# EAGLE design Robot (EAGLE 7.6.0)
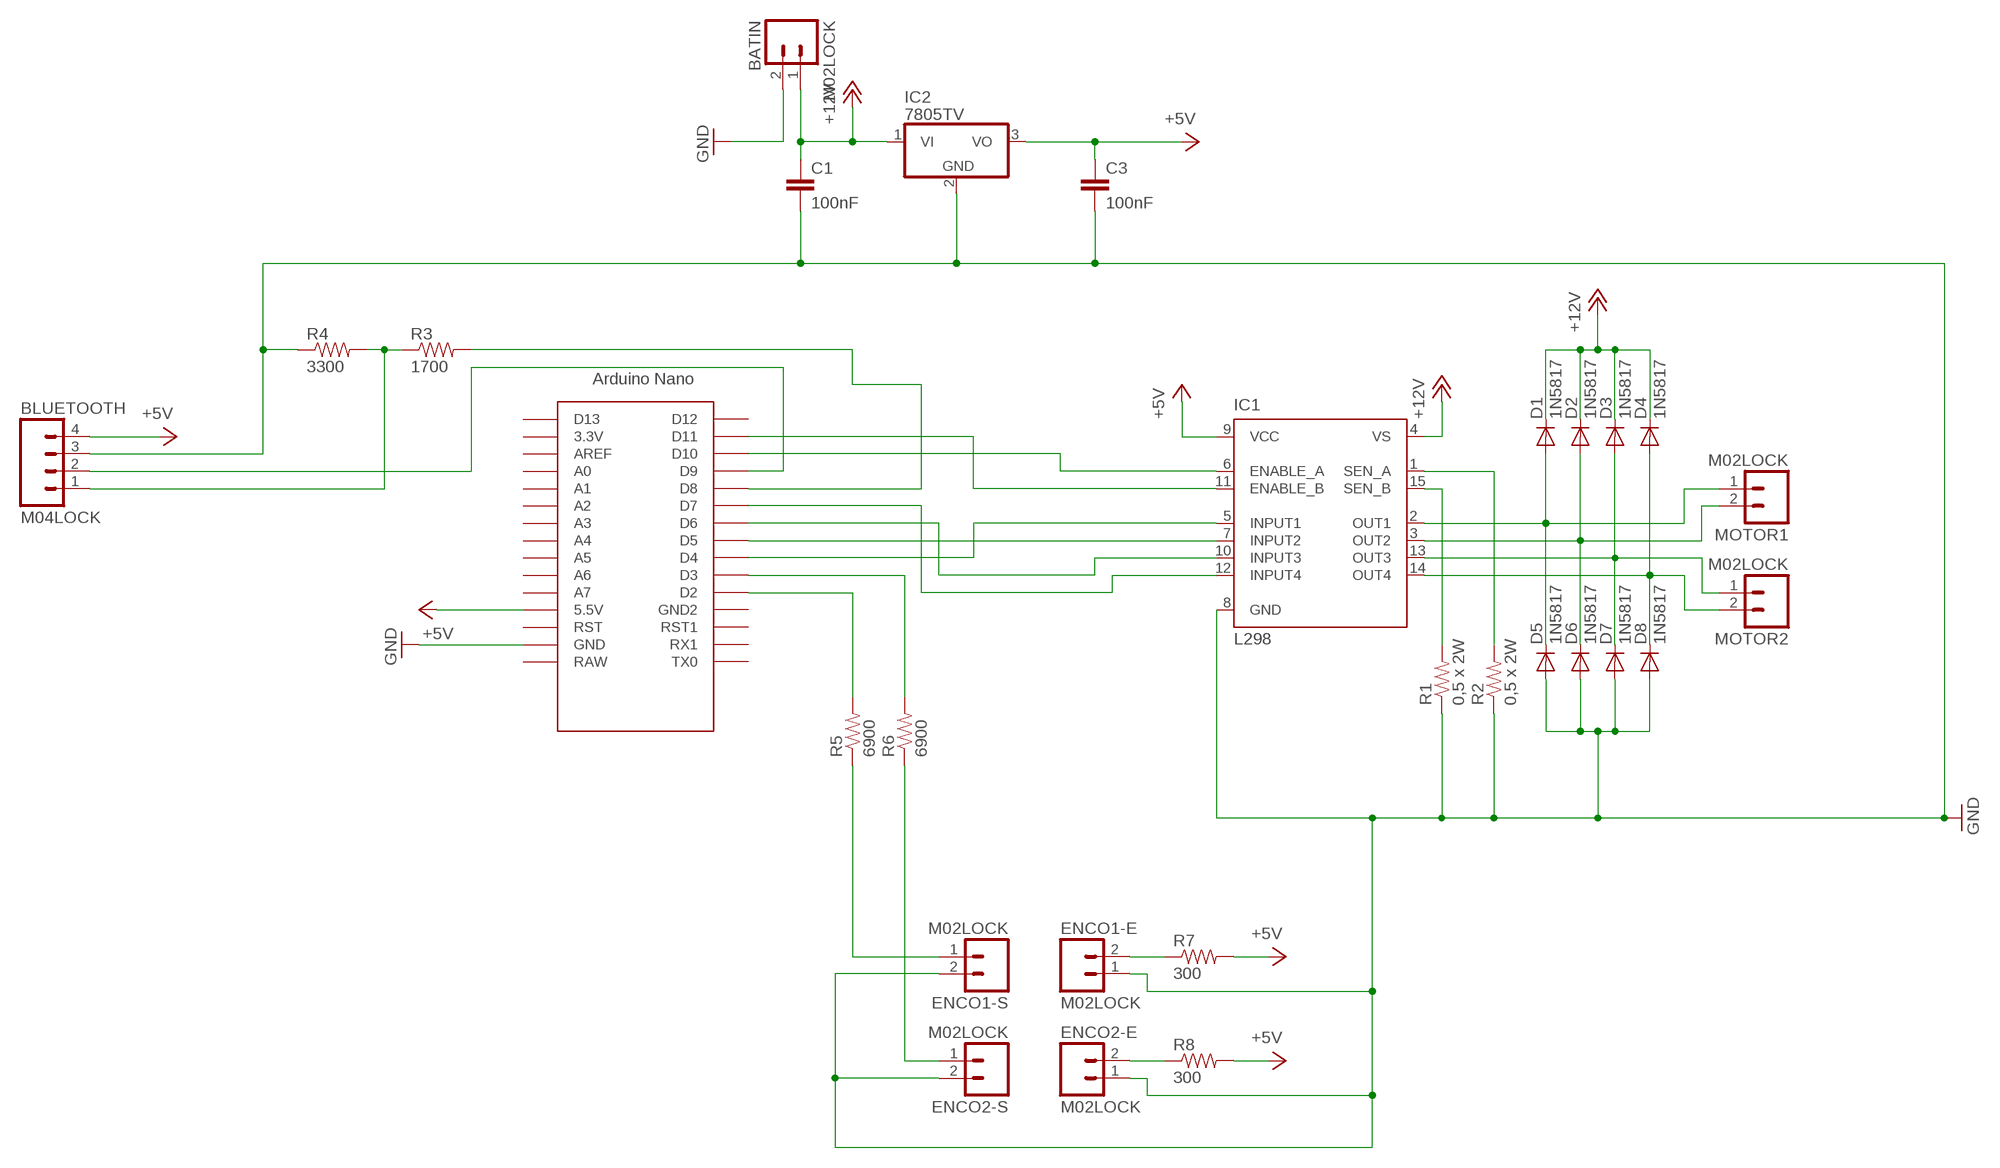
[diagram p0: schematic, sheet 1]

## Parts
BATIN  M02LOCK  [1X02_LOCK]
BLUETOOTH  M04LOCK  [1X04_LOCK]
C1  100nF  C-EU050-025X075  [C050-025X075]
C3  100nF  C-EU050-025X075  [C050-025X075]
D1  1N5817  1N4004  [DO41-10]
D2  1N5817  1N4004  [DO41-10]
D3  1N5817  1N4004  [DO41-10]
D4  1N5817  1N4004  [DO41-10]
D5  1N5817  1N4004  [DO41-10]
D6  1N5817  1N4004  [DO41-10]
D7  1N5817  1N4004  [DO41-10]
D8  1N5817  1N4004  [DO41-10]
ENCO1-E  M02LOCK  [1X02_LOCK]
ENCO1-S  M02LOCK  [1X02_LOCK]
ENCO2-E  M02LOCK  [1X02_LOCK]
ENCO2-S  M02LOCK  [1X02_LOCK]
IC1  L298  [MULTIWATT-15]
IC2  7805TV  [TO220V]
MOTOR1  M02LOCK  [1X02_LOCK]
MOTOR2  M02LOCK  [1X02_LOCK]
R1  0,5 x 2W  RESISTORPTH-1/2W  [AXIAL-0.5]
R2  0,5 x 2W  RESISTORPTH-1/2W  [AXIAL-0.5]
R3  1700  RESISTORAXIAL-0.3  [AXIAL-0.3]
R4  3300  RESISTORAXIAL-0.3  [AXIAL-0.3]
R5  6900  RESISTORAXIAL-0.3  [AXIAL-0.3]
R6  6900  RESISTORAXIAL-0.3  [AXIAL-0.3]
R7  300  RESISTORAXIAL-0.3  [AXIAL-0.3]
R8  300  RESISTORAXIAL-0.3  [AXIAL-0.3]
U$1  NANO  [NANO]

## Nets
+5V: BLUETOOTH.4 C3.1 IC1.9(VCC) IC2.3(VO) R7.P$2 R8.P$2 U$1.5V(5.5V)
+12V [12V]: BATIN.1 C1.1 D1.C D2.C D3.C D4.C IC1.4(VS) IC2.1(VI)
GND [12V]: BATIN.2 BLUETOOTH.3 C1.2 C3.2 D5.A D6.A D7.A D8.A ENCO1-E.1 ENCO1-S.2 ENCO2-E.1 ENCO2-S.2 IC1.8(GND) IC2.2(GND) R1.P$1 R2.P$1 R4.P$1 U$1.GND
N$1 [12V]: D1.A D5.C IC1.2(OUT1) MOTOR1.1
N$2: D3.A D7.C IC1.13(OUT3) MOTOR2.1
N$3: IC1.7(INPUT2) U$1.D5
N$4: D4.A D8.C IC1.14(OUT4) MOTOR2.2
N$6: R3.P$2 U$1.D8
N$7: D2.A D6.C IC1.3(OUT2) MOTOR1.2
N$8: IC1.5(INPUT1) U$1.D4
N$9: IC1.1(SEN_A) R2.P$2
N$10: IC1.15(SEN_B) R1.P$2
N$11: IC1.6(ENABLE_A) U$1.D10
N$12: BLUETOOTH.1 R3.P$1 R4.P$2
N$13: R5.P$2 U$1.D2
N$14: IC1.11(ENABLE_B) U$1.D11
N$15: IC1.10(INPUT3) U$1.D6
N$17: IC1.12(INPUT4) U$1.D7
N$18: BLUETOOTH.2 U$1.D9
N$20: R6.P$2 U$1.D3
N$21: ENCO1-S.1 R5.P$1
N$22: ENCO2-S.1 R6.P$1
N$23: ENCO1-E.2 R7.P$1
N$24: ENCO2-E.2 R8.P$1
Unconnected: U$1.3.3V U$1.A0 U$1.A1 U$1.A2 U$1.A3 U$1.A4 U$1.A5 U$1.A6 U$1.A7 U$1.AREF U$1.D12 U$1.D13 U$1.GND1(GND2) U$1.ICSP1 U$1.ICSP2 U$1.ICSP3 U$1.ICSP4 U$1.ICSP5 U$1.ICSP6 U$1.RAW U$1.RST U$1.RST1 U$1.RX1 U$1.TX0

## Library data of the parts
BATIN ENCO1-E ENCO1-S ENCO2-E ENCO2-S MOTOR1 MOTOR2 = SparkFun-Connectors:M02: Standard 2-pin 0.1" header. Use with - straight break away headers ( PRT-00116) - right angle break away headers (PRT-00553) - swiss pins (PRT-00743) - machine pins (PRT-00117) - female headers (PRT-00115) Molex polarized connector foot print use with: PRT-08233 with associated crimp pins and housings. 2.54_SCREWTERM for use with PRT-10571. 3.5mm Screw Terminal footprints for PRT-08084 5mm Screw Terminal footprints for use with PRT-08432
BLUETOOTH = SparkFun-Connectors:M04: Header 4 Standard 4-pin 0.1" header. Use with straight break away headers (SKU : PRT-00116), right angle break away headers (PRT-00553), swiss pins (PRT-00743), machine pins (PRT-00117), and female headers (PRT-00115). Molex polarized connector foot print use with SKU : PRT-08231 with associated crimp pins and housings. 1MM SMD Version SKU: PRT-10208; PROD_ID: CONN-09696
C1 C3 = resistor:C-EU: CAPACITOR, European symbol
D1-D8 = diode:1N4004: DIODE general purpose rectifier, 1 A
IC1 = st-microelectronics:L298: DUAL FULL-BRIDGE DRIVER
IC2 = linear:78*: Positive VOLTAGE REGULATOR Source: http://cache.national.com/ds/LM/LM78L05.pdf http://www.fairchildsemi.com/ds/LM/LM7805.pdf
R1-R8 = SparkFun-Resistors:RESISTOR: Resistor Basic schematic elements and footprints for 0603, 1206, and PTH resistors.
U$1 = Arduino-clone:NANO: Arduino Nano

## Net classes
0 default: width 0.254 mm
1 12V: width 0.508 mm

## Board
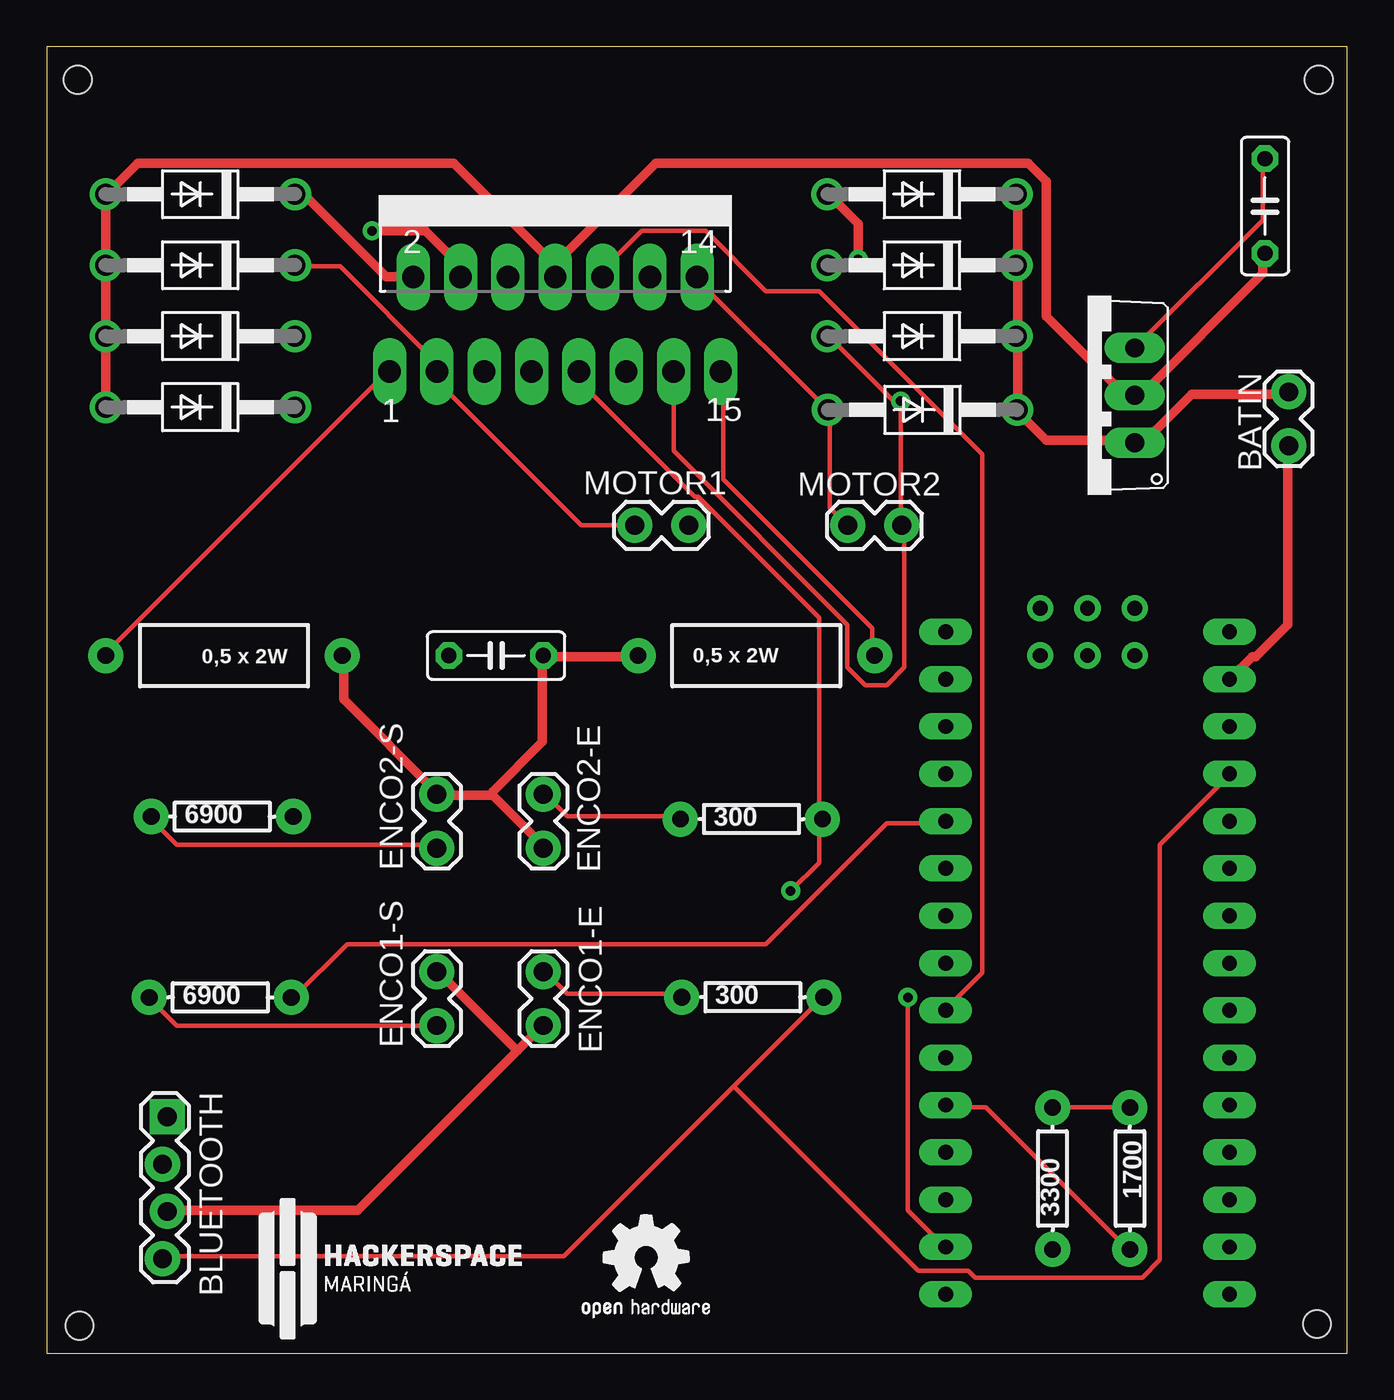
[diagram p1: board, top side]
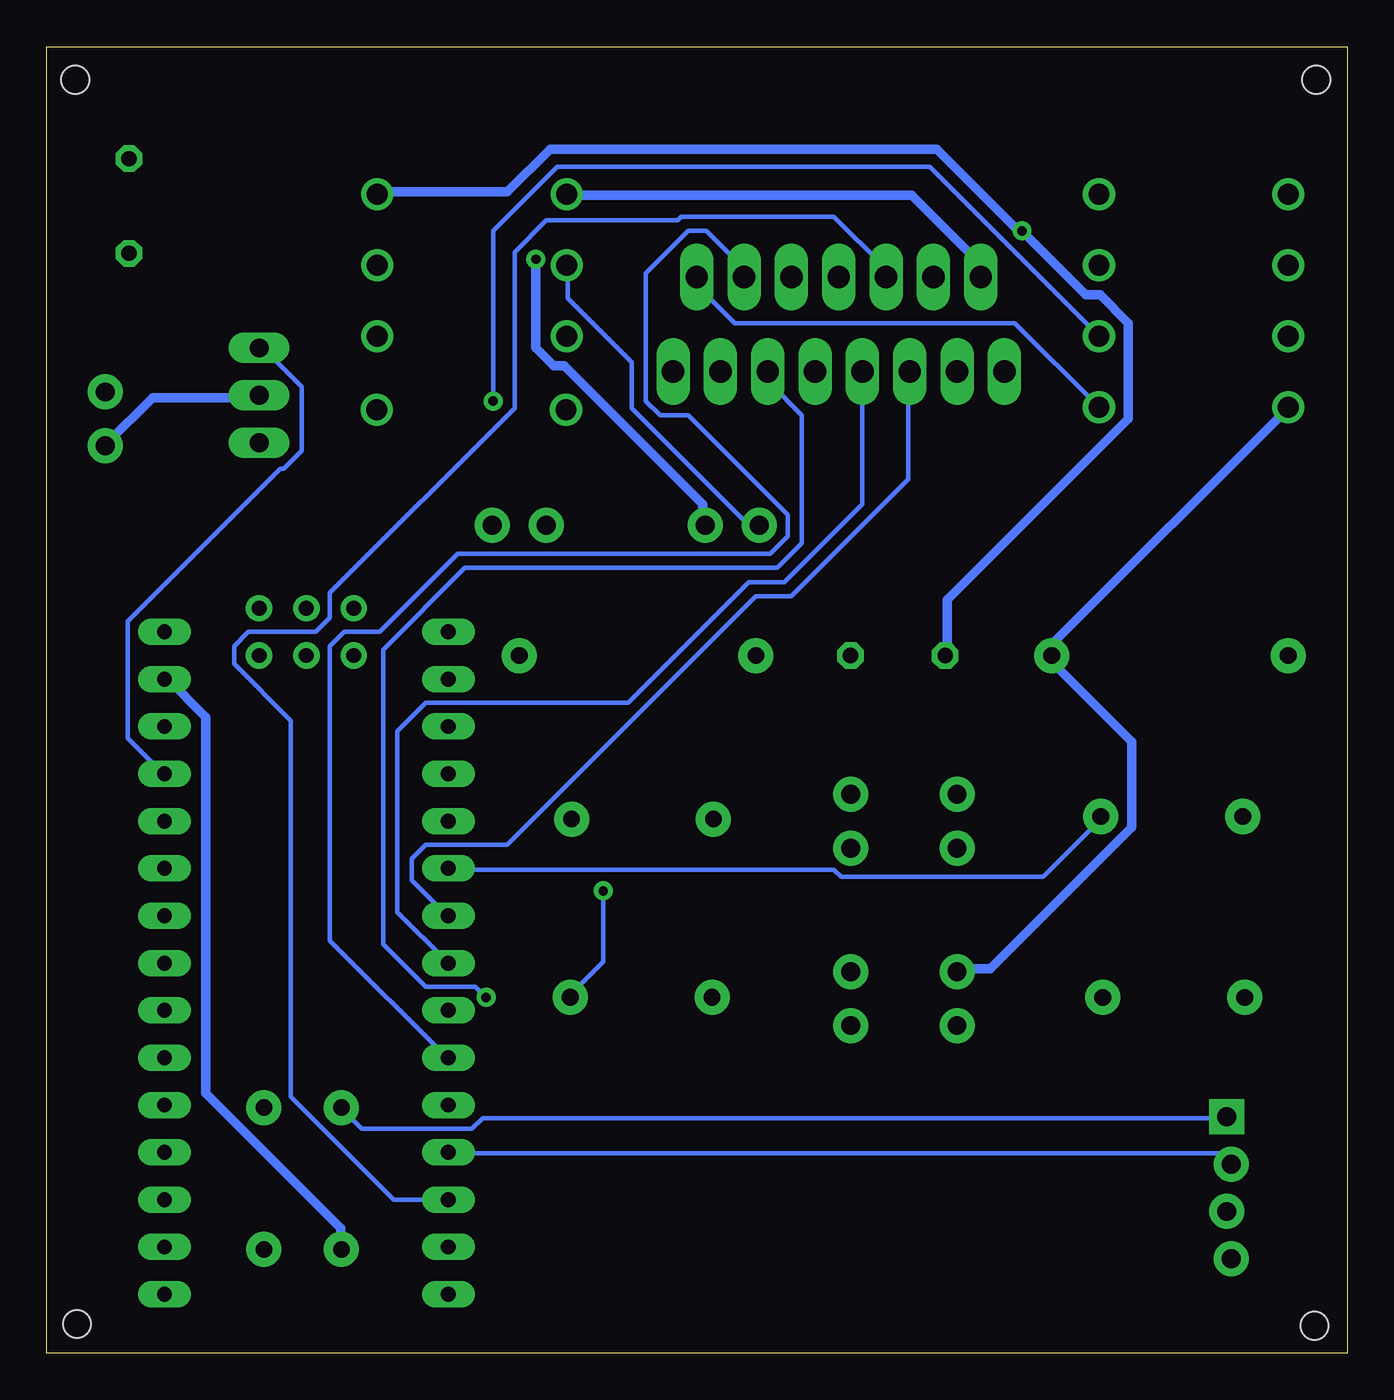
[diagram p2: board, bottom side, seen from below]

Size 69.83 x 70.16 mm. Coordinates in mm from the lower left corner, seen from the top.
Outline: 0,0 69.83,0 69.83,70.15 0,70.15 0,0
Copper layers (1*16): Top 0.035mm / dielectric 1.5mm / Bottom 0.035mm
Design rules "SparkFun *": minimum track width 8mil, minimum drill 20mil, track to track 20mil, track to pad 15mil, pad to pad 8mil, via to via 8mil, smd to smd 8mil, copper to edge 8mil, drill to drill 8mil, minimum pad ring 12mil, minimum via ring 10mil, stop-mask expansion 4mil, vias tented up to drill 20mil, thermal gap 10mil
Holes 1.5 mm at 1.67,68.37 68.29,68.37 68.2,1.58 1.76,1.48

### Footprints (pad centres in the part's own frame; a part is rotated, then mirrored left to right if it is on the bottom)
1X02_LOCK = drill 1.016 pad 1.88: 1 -0.178,0; 2 2.718,0
1X04_LOCK = drill 1.016 pad 1.88 square: 1 0,0.127 | drill 1.016 pad 1.88: 2 2.54,-0.127; 3 5.08,0.127; 4 7.62,-0.127
C050-025X075 = drill 0.813 octagon: 1 -2.54,0; 2 2.54,0
DO41-10 = drill 1.118: A 5.08,0; C -5.08,0
MULTIWATT-15 = drill 1.2 long: 1 -8.89,-7.62; 2 -7.62,-2.54; 3 -6.35,-7.62; 4 -5.08,-2.54; 5 -3.81,-7.62; 6 -2.54,-2.54; 7 -1.27,-7.62; 8 0,-2.54; 9 1.27,-7.62; 10 2.54,-2.54; 11 3.81,-7.62; 12 5.08,-2.54; 13 6.35,-7.62; 14 7.62,-2.54; 15 8.89,-7.62
TO220V = drill 1.016 long: 1 -2.54,-2.54; 2 0,-2.54; 3 2.54,-2.54
AXIAL-0.5 = drill 0.9 pad 1.88: P$1 -6.35,0; P$2 6.35,0
AXIAL-0.3 = drill 0.9 pad 1.88: P$1 -3.81,0; P$2 3.81,0
NANO = drill 0.8 long: 3.3V -10.16,24.13; 5V -10.16,-1.27; A0 -10.16,19.05; A1 -10.16,16.51; A2 -10.16,13.97; A3 -10.16,11.43; A4 -10.16,8.89; A5 -10.16,6.35; A6 -10.16,3.81; A7 -10.16,1.27; AREF -10.16,21.59; D2 5.08,1.27; D3 5.08,3.81; D4 5.08,6.35; D5 5.08,8.89; D6 5.08,11.43; D7 5.08,13.97; D8 5.08,16.51; D9 5.08,19.05; D10 5.08,21.59; D11 5.08,24.13; D12 5.08,26.67; D13 -10.16,26.67; GND -10.16,-6.35; GND1 5.08,-1.27; RAW -10.16,-8.89; RST -10.16,-3.81; RST1 5.08,-3.81; RX1 5.08,-6.35; TX0 5.08,-8.89 | drill 0.8: ICSP1 -5.08,-10.16; ICSP2 -5.08,-7.62; ICSP3 -2.54,-10.16; ICSP4 -2.54,-7.62; ICSP5 0,-10.16; ICSP6 0,-7.62

### Placement (x,y rotation side)
BATIN  66.68,51.44 270 top
BLUETOOTH  6.35,12.7 270 top
C1  24.13,37.47 0 top
C3  65.41,61.59 270 top
D1  46.99,62.23 180 top
D2  46.99,58.42 180 top
D3  46.99,54.61 180 top
D4  47.03,50.65 180 top
D5  8.25,62.23 180 top
D6  8.25,58.42 180 top
D7  8.25,54.61 180 top
D8  8.25,50.8 180 top
ENCO1-E  26.67,17.78 90 top
ENCO1-S  20.95,17.78 90 top
ENCO2-E  26.67,27.3 90 top
ENCO2-S  20.95,27.3 90 top
IC1  27.3,60.33 0 top
IC2  55.88,51.44 90 top
MOTOR1  34.29,44.45 180 top
MOTOR2  45.72,44.45 180 top
R1  38.1,37.47 0 top
R2  9.52,37.47 180 top
R3  58.16,9.39 270 top
R4  54,9.39 90 top
R5  9.32,19.11 0 top
R6  9.43,28.82 0 top
R7  37.91,19.12 0 top
R8  37.84,28.69 0 top
U$1  53.34,29.85 180 top
U$2  [OSHW2]  28.37,0.87 0 top

### Tracks (layer width: path | path; a pad name or v marks a point on that pad's centre or on a via)
+5V  (via drill 0.51)
  Top 0.254: C3.1 65.28,64.07 65.28,60.83 IC2.3 | IC1.9 28.71,52.64 28.71,52.07 34.8,45.97 34.99,45.97 41.47,39.5 41.47,28.83 R8.P$2 41.47,28.64 41.47,26.35 v39.95,24.83 | 36.9,14.35 41.66,19.11 R7.P$2 | 36.9,14.35 27.75,5.21 6.23,5.21 BLUETOOTH.4 | 36.9,14.35 46.8,4.45 49.47,4.45 49.85,4.06 58.81,4.06 59.76,5.02 59.76,27.31 63.38,30.93 U$1.5V
  Bottom 0.254: U$1.5V 63.57,31.12 65.47,33.02 65.47,39.31 57.28,47.5 57.09,47.5 56.14,48.45 56.14,51.88 58.24,53.98 IC2.3 | v39.95,24.83 39.95,21.02 41.66,19.3 R7.P$2
+12V  (via drill 0.51)
  Top 0.508: D1.C 52.14,62.17 52.14,58.55 D2.C 52.14,58.36 52.14,54.74 D3.C 52.14,54.55 52.14,50.74 D4.C 52.14,50.55 53.66,49.02 58.24,49.02 IC2.1 58.62,49.02 59,49.02 61.47,51.5 66.62,51.5 BATIN.1 | v17.47,60.26 20.33,60.26 22.04,58.55 22.04,57.79 IC1.4
  Bottom 0.508: C1.1 21.47,37.59 21.47,40.45 11.75,50.17 11.75,55.31 13.28,56.83 14.04,56.83 v17.47,60.26 17.66,60.26 22.04,64.64 42.8,64.64 45.09,62.36 51.95,62.36 D1.C
GND
  Top 0.508: C3.2 65.28,58.93 65.28,57.98 58.81,51.5 58.43,51.5 IC2.2 58.24,51.5 57.85,51.5 53.66,55.69 53.66,62.93 52.71,63.88 32.71,63.88 27.37,58.55 IC1.8 27.18,57.79 27.18,58.55 21.85,63.88 4.9,63.88 3.37,62.36 D5.A 3.18,62.17 3.18,58.55 D6.A 3.18,58.17 3.18,54.74 D7.A 3.18,54.55 3.18,50.93 D8.A | U$1.GND 63.57,36.26 64.71,37.4 64.9,37.4 66.62,39.12 66.62,48.64 BATIN.2 | 25.28,16.26 26.61,17.59 ENCO1-E.1 | 25.28,16.26 16.71,7.68 6.61,7.68 BLUETOOTH.3 | 25.28,16.26 21.09,20.45 ENCO1-S.2 | R1.P$1 31.57,37.4 26.8,37.4 C1.2 26.61,37.21 26.61,32.83 23.94,30.16 23.94,29.97 | 23.94,29.97 21.09,29.97 ENCO2-S.2 20.9,30.16 15.94,35.12 15.94,37.4 R2.P$1 | 23.94,29.97 26.61,27.31 ENCO2-E.1
  Bottom 0.508: R4.P$1 54.04,5.59 54.04,6.73 61.28,13.97 61.28,34.16 63.38,36.26 U$1.GND | IC2.2 58.43,51.31 64.14,51.31 66.62,48.83 BATIN.2 | D8.A 3.18,50.74 15.75,38.16 15.75,37.59 R2.P$1 15.94,37.21 11.56,32.83 11.56,28.26 19.18,20.64 20.9,20.64 ENCO1-S.2
N$1  (via drill 0.51)
  Top 0.508: D5.C 13.47,62.17 13.85,62.17 18.23,57.79 19.56,57.79 IC1.2 | v43.57,58.74 43.57,60.64 42.04,62.17 D1.A
  Bottom 0.508: D1.A 41.85,62.17 23.37,62.17 19.75,58.55 19.75,57.79 IC1.2 | v43.57,58.74 43.57,53.98 42.61,53.02 42.04,53.02 34.61,45.59 34.61,44.45 MOTOR1.1
N$2  (via drill 0.51)
  Top 0.254: IC1.13 33.66,52.64 33.66,48.45 43,39.12 43,36.83 43.95,35.88 45.09,35.88 46.04,36.83 46.04,44.26 MOTOR2.1 45.85,44.45 v45.85,51.12 45.47,51.12 42.04,54.55 D3.A
  Bottom 0.254: v45.85,51.12 45.85,60.26 42.42,63.69 22.42,63.69 13.47,54.74 D7.C
N$3
  Bottom 0.254: U$1.D5 48.33,21.02 51,23.69 51,33.4 49.47,34.93 38.61,34.93 32.14,41.4 30.23,41.4 26.04,45.59 26.04,52.64 IC1.7
N$4
  Top 0.254: MOTOR2.2 42.04,45.4 42.04,50.55 D4.A 41.85,50.74 34.99,57.6 IC1.14
  Bottom 0.254: D8.C 13.47,50.93 17.85,55.31 32.9,55.31 34.8,57.21 34.8,57.6 IC1.14
N$6
  Top 0.254: U$1.D8 48.33,13.21 50.42,13.21 58.04,5.59 R3.P$2
N$7
  Top 0.254: D6.C 13.47,58.36 15.75,58.36 20.9,53.21 20.9,52.83 IC1.3 21.09,52.64 21.09,52.07 28.71,44.45 MOTOR1.2
  Bottom 0.254: D2.A 41.85,58.36 41.85,56.64 38.42,53.21 38.42,50.74 32.14,44.45 31.76,44.45 MOTOR1.2
N$8
  Bottom 0.254: U$1.D4 48.33,23.5 50.23,25.4 50.23,26.54 49.47,27.31 45.09,27.31 31.76,40.64 29.85,40.64 23.56,46.93 23.56,52.64 IC1.5
N$9
  Top 0.254: IC1.1 18.23,52.64 3.18,37.59 R2.P$2
N$10
  Top 0.254: IC1.15 36.33,52.64 36.33,46.93 44.33,38.93 44.33,37.59 R1.P$2
N$11
  Bottom 0.254: U$1.D10 48.33,8.26 51.19,8.26 56.71,13.78 56.71,33.97 59.76,37.02 59.76,37.97 59,38.74 55.38,38.74 54.62,39.5 54.62,40.83 44.71,50.74 44.71,59.12 43,60.83 35.95,60.83 35.76,61.02 27.56,61.02 24.9,58.36 24.9,57.79 IC1.6
N$12
  Top 0.254: R3.P$1 58.04,13.21 54.04,13.21 R4.P$2
  Bottom 0.254: BLUETOOTH.1 6.61,12.64 46.42,12.64 47,12.07 52.9,12.07 53.85,13.02 R4.P$2
N$13
  Top 0.254: U$1.D2 48.14,28.45 45.09,28.45 38.61,21.97 16.13,21.97 13.28,19.11 R5.P$2
N$14  (via drill 0.51)
  Top 0.254: v46.23,19.11 46.23,7.68 48.14,5.78 U$1.D11
  Bottom 0.254: v46.23,19.11 46.8,19.69 49.47,19.69 51.76,21.97 51.76,37.78 47.38,42.17 30.61,42.17 29.28,43.5 29.28,50.36 30.99,52.07 30.99,52.64 IC1.11
N$15
  Top 0.254: U$1.D6 48.33,18.54 50.23,20.45 50.23,48.26 41.47,57.02 38.61,57.02 35.37,60.26 31.95,60.26 29.85,58.17 IC1.10
N$17
  Bottom 0.254: U$1.D7 48.33,15.88 54.62,22.16 54.62,37.97 53.85,38.74 51.95,38.74 47.76,42.93 30.99,42.93 30.04,43.88 30.04,45.02 35.37,50.36 36.9,50.36 37.66,51.12 37.66,57.98 35.37,60.26 34.42,60.26 32.52,58.36 32.52,57.79 IC1.12
N$18
  Bottom 0.254: U$1.D9 48.14,10.73 6.8,10.73 BLUETOOTH.2
N$20
  Bottom 0.254: U$1.D3 48.14,25.97 27.56,25.97 27.18,25.59 16.32,25.59 13.28,28.64 R6.P$2
N$21
  Top 0.254: ENCO1-S.1 20.9,17.59 6.99,17.59 5.66,18.92 R5.P$1
N$22
  Top 0.254: ENCO2-S.1 20.9,27.31 6.99,27.31 5.66,28.64 R6.P$1
N$23
  Top 0.254: R7.P$1 34.04,19.3 27.95,19.3 26.8,20.45 ENCO1-E.2
N$24
  Top 0.254: R8.P$1 33.85,28.83 27.95,28.83 26.8,29.97 ENCO2-E.2